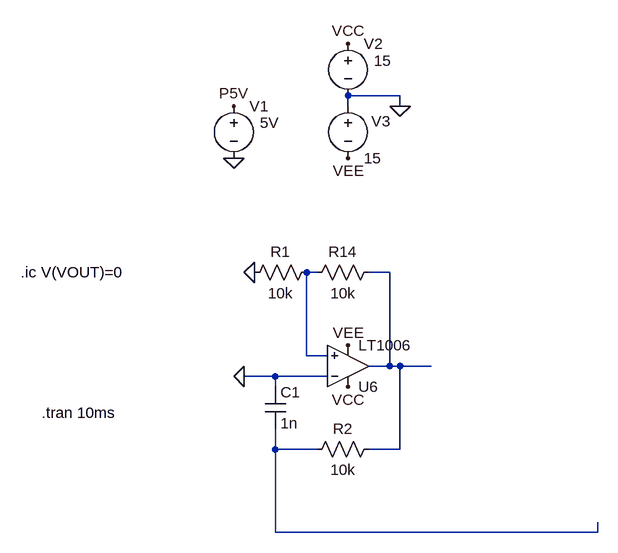
[diagram p0: schematic Draft04.asc]
Draft04.asc, the LTspice schematic file:
Version 4
SHEET 1 2720 868
WIRE -496 -112 -576 -112
WIRE -576 -96 -576 -112
WIRE -496 -96 -496 -112
WIRE -624 160 -640 160
WIRE -512 160 -544 160
WIRE -640 288 -640 160
WIRE -608 288 -640 288
WIRE -512 304 -512 160
WIRE -512 304 -544 304
WIRE -496 304 -512 304
WIRE -448 304 -496 304
WIRE -688 320 -736 320
WIRE -608 320 -688 320
WIRE -688 336 -688 320
WIRE -688 432 -688 400
WIRE -624 432 -688 432
WIRE -496 432 -496 304
WIRE -496 432 -544 432
WIRE -688 560 -688 432
WIRE -192 560 -192 544
WIRE -192 560 -688 560
FLAG -496 -96 0
FLAG -576 -192 VCC
FLAG -576 -16 VEE
FLAG -752 -96 P5V
FLAG -752 -16 0
FLAG -720 160 0
FLAG -576 336 VCC
FLAG -576 272 VEE
FLAG -736 320 0
SYMBOL voltage -576 -208 R0
WINDOW 123 0 0 Left 0
WINDOW 39 0 0 Left 0
WINDOW 3 40 42 Left 2
SYMATTR Value 15
SYMATTR InstName V2
SYMBOL voltage -576 -112 R0
WINDOW 123 0 0 Left 0
WINDOW 39 0 0 Left 0
WINDOW 0 36 39 Left 2
SYMATTR InstName V3
SYMATTR Value 15
SYMBOL voltage -752 -112 R0
WINDOW 123 0 0 Left 0
WINDOW 39 0 0 Left 0
WINDOW 3 40 42 Left 2
SYMATTR Value 5V
SYMATTR InstName V1
SYMBOL OpAmps\\LT1006 -576 368 M180
SYMATTR InstName U6
SYMBOL res -624 144 R90
WINDOW 0 0 56 VBottom 2
WINDOW 3 32 56 VTop 2
SYMATTR InstName R1
SYMATTR Value 10k
SYMBOL res -528 144 R90
WINDOW 0 0 56 VBottom 2
WINDOW 3 32 56 VTop 2
SYMATTR InstName R14
SYMATTR Value 10k
SYMBOL res -528 416 R90
WINDOW 0 0 56 VBottom 2
WINDOW 3 32 56 VTop 2
SYMATTR InstName R2
SYMATTR Value 10k
SYMBOL cap -704 336 R0
SYMATTR InstName C1
SYMATTR Value 1n
TEXT -1048 376 Left 2 !.tran 10ms
TEXT -1080 160 Left 2 !.ic V(VOUT)=0

The netlist it stands for:
* Draft04.asc
V2 VCC 0 15
V3 0 VEE 15
V1 P5V 0 5V
XU6 N001 0 VCC VEE N002 LT1006  ; pins In+ In- V+ V- OUT
R1 N001 0 10k
R14 N002 N001 10k
R2 N002 N003 10k
C1 0 N003 1n
.tran 10ms
.ic V(VOUT)=0
.lib LTC.lib
.backanno
.end